# EAGLE design rt_ctl (EAGLE 5.10)
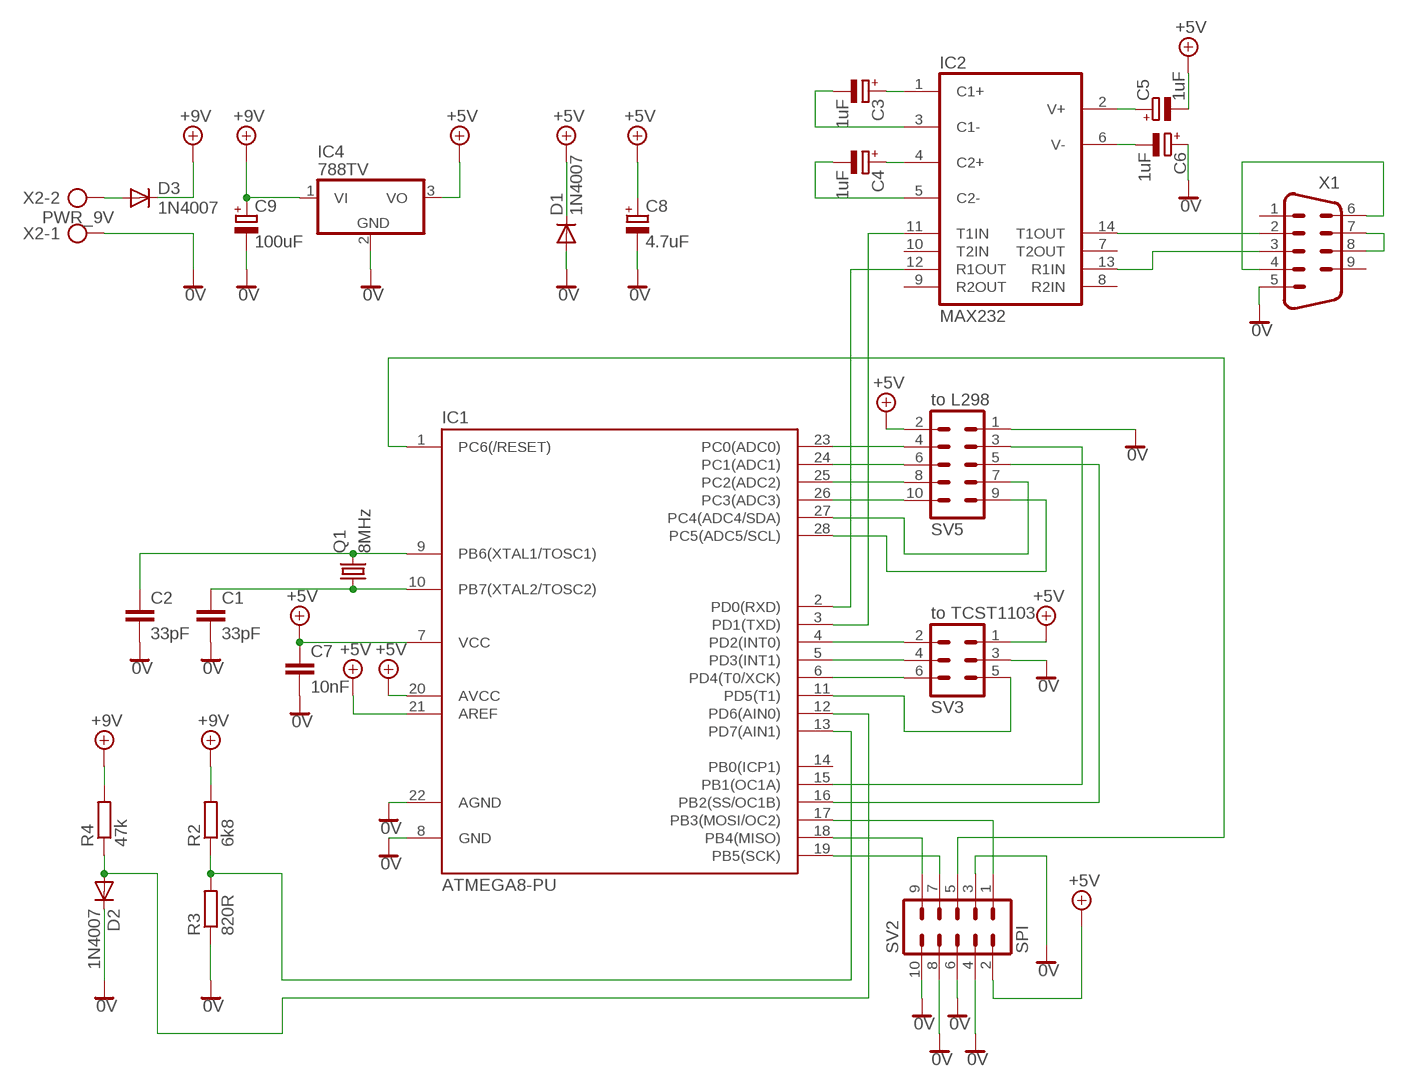
[diagram p0: schematic, sheet 1]

## Parts
C1  33pF  C7.5/3  [C7.5B3]
C2  33pF  C7.5/3  [C7.5B3]
C3  1uF  CPOL-EUE2.5-5  [E2,5-5]
C4  1uF  CPOL-EUE2.5-5  [E2,5-5]
C5  1uF  CPOL-EUE2.5-5  [E2,5-5]
C6  1uF  CPOL-EUE2.5-5  [E2,5-5]
C7  10nF  C7.5/3  [C7.5B3]
C8  4.7uF  CPOL-EUE2.5-7  [E2,5-7]
C9  100uF  CPOL-EUE3.5-10  [E3,5-10]
D1  1N4007  1N4004  [DO41-10]
D2  1N4007  1N4004  [DO41-10]
D3  1N4007  1N4004  [DO41-10]
IC1  ATMEGA8-PU  [DIL28-3]
IC2  MAX232  [DIL16]
IC4  788TV  [TO220V]
Q1  8MHz  CRYSTALHC49U-V  [HC49U-V]
R2  6k8  R-EU_0207/12  [0207/12]
R3  820R  R-EU_0207/12  [0207/12]
R4  47k  R-EU_0207/12  [0207/12]
SV2  SPI  ML10  [ML10]
SV3  to TCST1103  ML6  [ML6]
SV5  to L298  ML10  [ML10]
X1  M09HP  [M09HP]
X2  PWR_9V  AK300/2  [AK300/2]

## Nets
+5V: C5.- C7.1 C8.+ D1.C IC1.7(VCC) IC1.20(AVCC) IC1.21(AREF) IC4.3(VO) SV2.2 SV3.1 SV5.2
+9V: C9.+ D3.C IC4.1(VI) R2.2 R4.2
AAA: C1.2 C2.2 C6.+ C7.2 C8.- C9.- D1.A D2.C IC1.8(GND) IC1.22(AGND) IC4.2(GND) R3.1 SV2.3 SV2.4 SV2.6 SV2.8 SV2.10 SV3.3 SV5.1 X1.5 X2.1 ; supply symbol labelled 0V
N$1: C2.1 IC1.9(PB6(XTAL1/TOSC1)) Q1.2
N$2: C1.1 IC1.10(PB7(XTAL2/TOSC2)) Q1.1
N$3: IC1.1(PC6(/RESET)) SV2.5
N$4: IC1.2(PD0(RXD)) IC2.12(R1OUT)
N$5: IC1.3(PD1(TXD)) IC2.11(T1IN)
N$6: C3.+ IC2.1(C1+)
N$7: C4.+ IC2.4(C2+)
N$8: C5.+ IC2.2(V+)
N$9: C6.- IC2.6(V-)
N$10: C3.- IC2.3(C1-)
N$11: C4.- IC2.5(C2-)
N$12: IC2.14(T1OUT) X1.2
N$13: IC2.13(R1IN) X1.3
N$14: D2.A IC1.12(PD6(AIN0)) R4.1
N$15: X1.7 X1.8
N$16: X1.4 X1.6
N$17: IC1.23(PC0(ADC0)) SV5.4
N$18: IC1.24(PC1(ADC1)) SV5.6
N$19: IC1.25(PC2(ADC2)) SV5.8
N$20: IC1.26(PC3(ADC3)) SV5.10
N$21: IC1.27(PC4(ADC4/SDA)) SV5.7
N$22: IC1.28(PC5(ADC5/SCL)) SV5.9
N$23: IC1.15(PB1(OC1A)) SV5.3
N$24: D3.A X2.2
N$25: IC1.13(PD7(AIN1)) R2.1 R3.2
N$26: IC1.16(PB2(SS/OC1B)) SV5.5
N$27: IC1.4(PD2(INT0)) SV3.2
N$28: IC1.5(PD3(INT1)) SV3.4
N$29: IC1.18(PB4(MISO)) SV2.9
N$30: IC1.19(PB5(SCK)) SV2.7
N$31: IC1.17(PB3(MOSI/OC2)) SV2.1
N$32: IC1.6(PD4(T0/XCK)) SV3.6
N$33: IC1.11(PD5(T1)) SV3.5
Unconnected: IC1.14(PB0(ICP1)) IC2.7(T2OUT) IC2.8(R2IN) IC2.9(R2OUT) IC2.10(T2IN) X1.1 X1.9

## Power pins joined to a net without a drawn wire
GND: IC2.15(GND)
VCC: IC2.16(VCC)

## Library data of the parts
C1 C2 C7 = capacitor-wima:C: CAPACITOR naming: grid - package width
C3-C6 C8 C9 = rcl:CPOL-EU: POLARIZED CAPACITOR, European symbol
D1-D3 = diode:1N4004: DIODE general purpose rectifier, 1 A
IC1 = atmega8:ATMEGA8-PU
IC2 = maxim:MAX232: RS232 TRANSEIVER
IC4 = linear:78*: Positive VOLTAGE REGULATOR Source: http://cache.national.com/ds/LM/LM78L05.pdf http://www.fairchildsemi.com/ds/LM/LM7805.pdf
Q1 = crystal:CRYSTAL: CRYSTAL
R2-R4 = resistor:R-EU_: RESISTOR, European symbol
SV2 SV5 = con-harting-ml:ML10: HARTING
SV3 = con-harting-ml:ML6: HARTING
X1 = con-subd:M09: SUB-D
X2 = con-ptr500:AK300/2: CONNECTOR

## Board
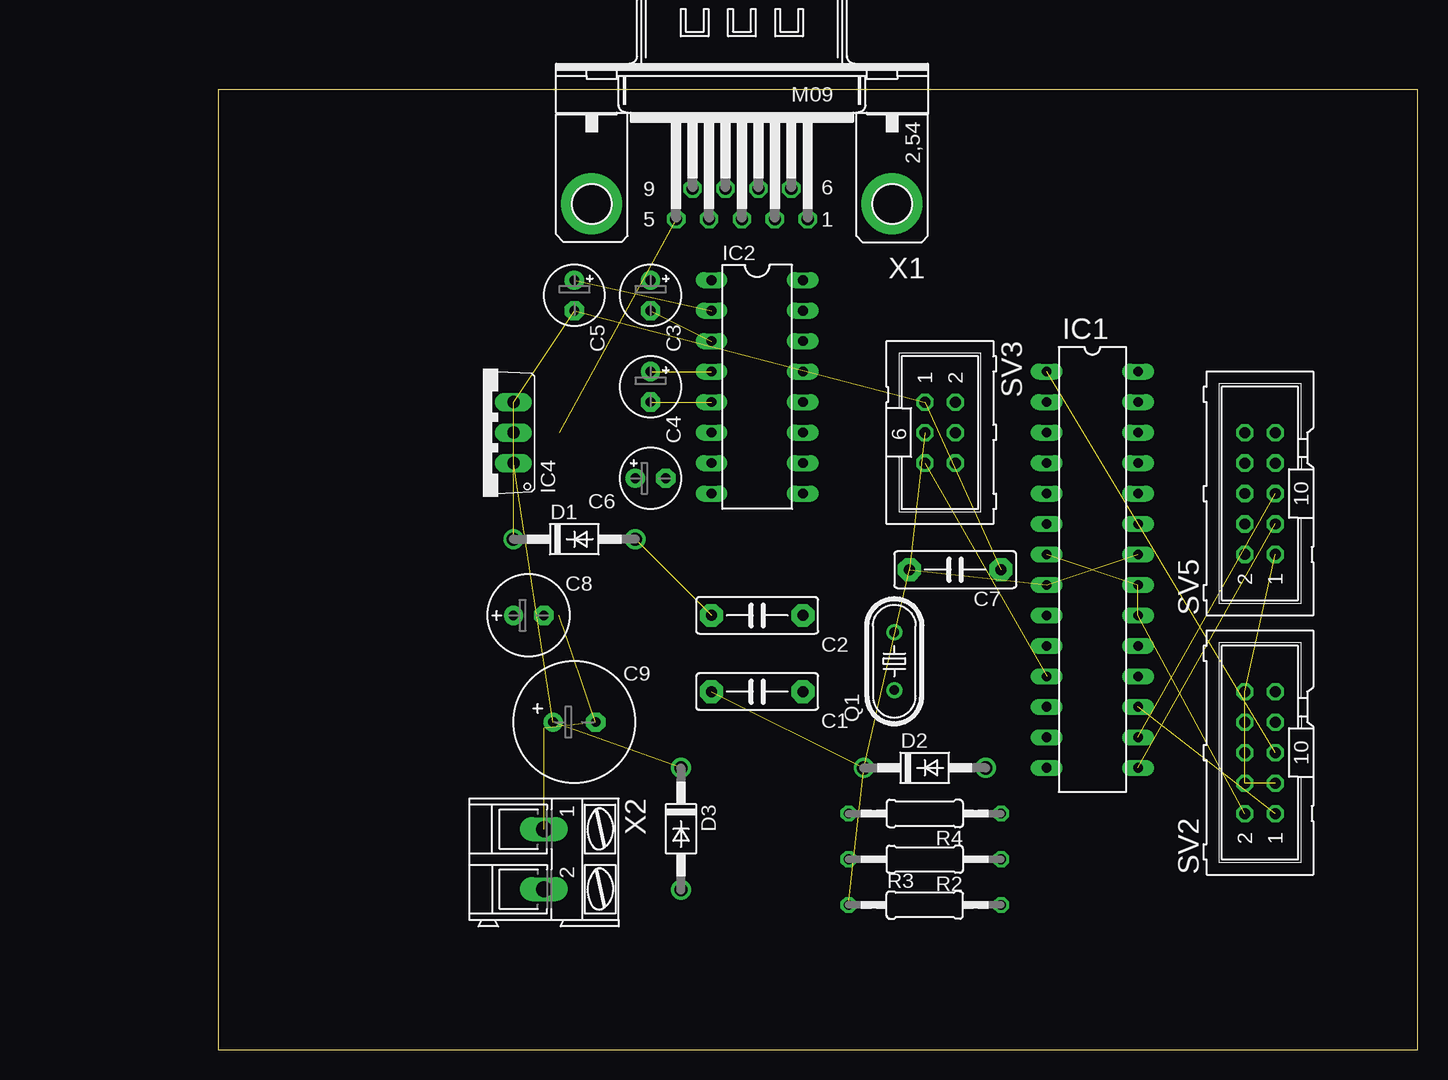
[diagram p1: board, top side]
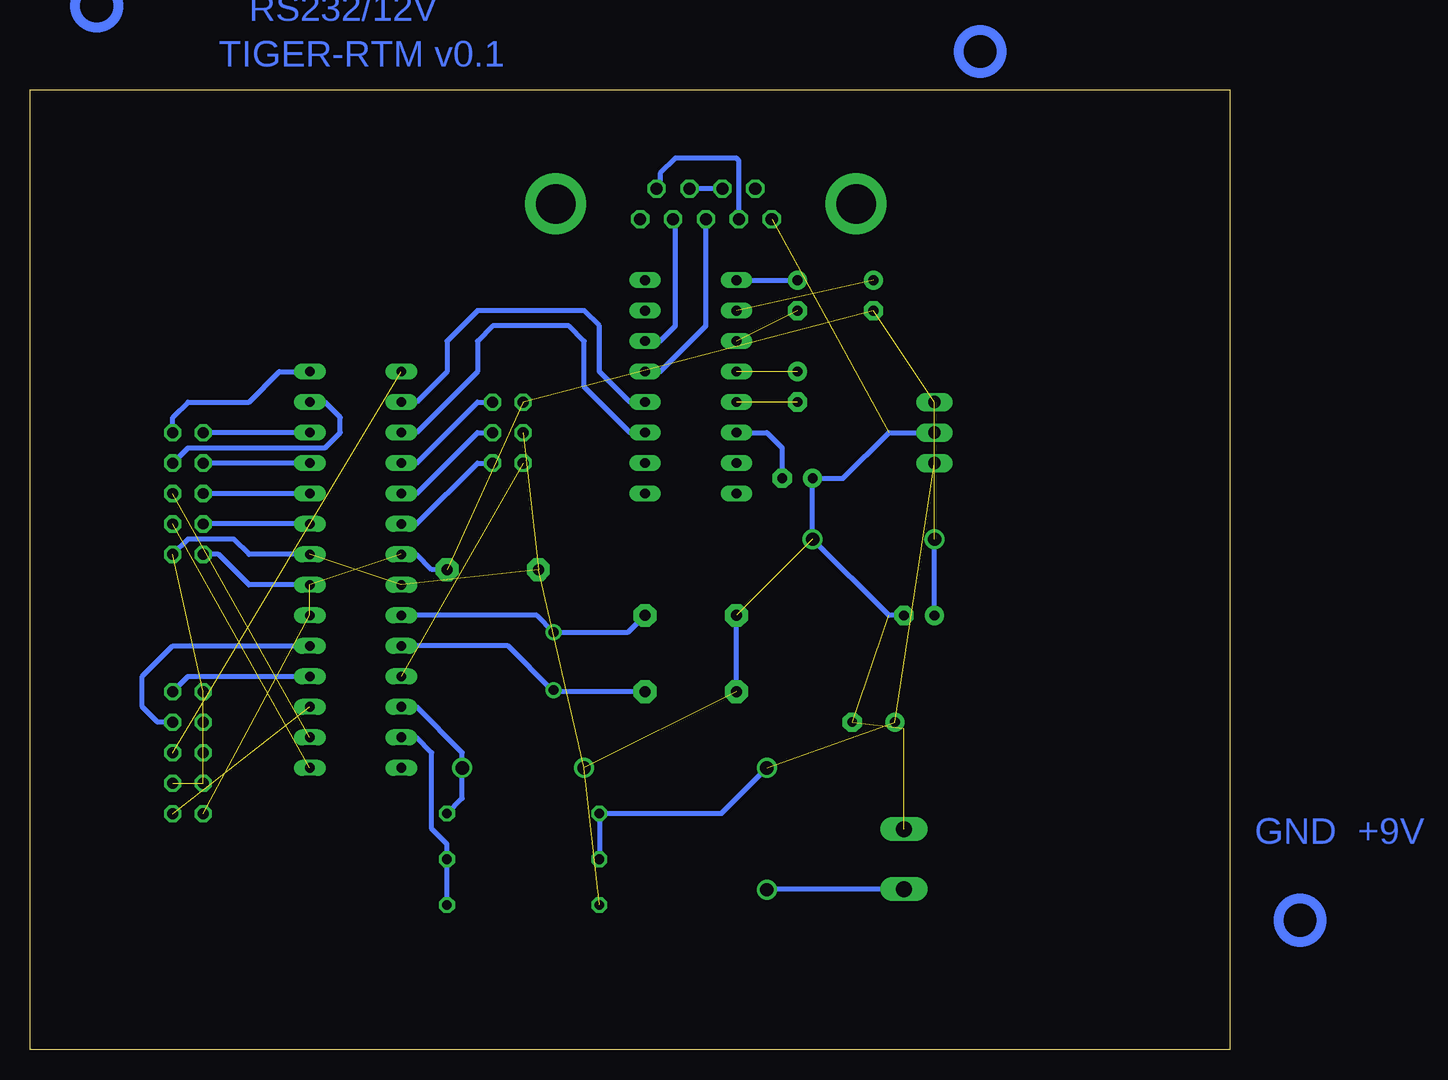
[diagram p2: board, bottom side, seen from below]

Size 100 x 80 mm. Coordinates in mm from the lower left corner, seen from the top.
Outline: 0,0 100,0 100,80 0,80 0,0
Copper layers (1*16): Top 0.035mm / dielectric 1.5mm / Bottom 0.035mm
Design rules "default": minimum track width 10mil, minimum drill 24mil, track to track 8mil, track to pad 8mil, pad to pad 8mil, via to via 8mil, smd to smd 8mil, copper to edge 40mil, drill to drill 8mil, minimum pad ring 10mil, minimum via ring 8mil, stop-mask expansion 4mil, vias tented up to drill 0mil, thermal gap 10mil

### Footprints (pad centres in the part's own frame; a part is rotated, then mirrored left to right if it is on the bottom)
C7.5B3 = drill 0.914 pad 1.905 octagon: 1 -3.81,0; 2 3.81,0
E2,5-5 = drill 0.813 pad 1.6 round: + -1.27,0 | drill 0.813 pad 1.6 octagon: - 1.27,0
E2,5-7 = drill 0.813 pad 1.6 round: + -1.27,0 | drill 0.813 pad 1.6 octagon: - 1.27,0
E3,5-10 = drill 0.813 pad 1.6 round: + -1.778,0 | drill 0.813 pad 1.6 octagon: - 1.778,0
DO41-10 = drill 1.118 round: A 5.08,0; C -5.08,0
DIL28-3 = drill 0.813 long: 1 -16.51,-3.81; 2 -13.97,-3.81; 3 -11.43,-3.81; 4 -8.89,-3.81; 5 -6.35,-3.81; 6 -3.81,-3.81; 7 -1.27,-3.81; 8 1.27,-3.81; 9 3.81,-3.81; 10 6.35,-3.81; 11 8.89,-3.81; 12 11.43,-3.81; 13 13.97,-3.81; 14 16.51,-3.81; 15 16.51,3.81; 16 13.97,3.81; 17 11.43,3.81; 18 8.89,3.81; 19 6.35,3.81; 20 3.81,3.81; 21 1.27,3.81; 22 -1.27,3.81; 23 -3.81,3.81; 24 -6.35,3.81; 25 -8.89,3.81; 26 -11.43,3.81; 27 -13.97,3.81; 28 -16.51,3.81
DIL16 = drill 0.813 long: 1 -8.89,-3.81; 2 -6.35,-3.81; 3 -3.81,-3.81; 4 -1.27,-3.81; 5 1.27,-3.81; 6 3.81,-3.81; 7 6.35,-3.81; 8 8.89,-3.81; 9 8.89,3.81; 10 6.35,3.81; 11 3.81,3.81; 12 1.27,3.81; 13 -1.27,3.81; 14 -3.81,3.81; 15 -6.35,3.81; 16 -8.89,3.81
TO220V = drill 1.016 long: 1 -2.54,-2.54; 2 0,-2.54; 3 2.54,-2.54
HC49U-V = drill 0.813 round: 1 -2.413,0; 2 2.413,0
0207/12 = drill 0.813 octagon: 1 -6.35,0; 2 6.35,0
ML10 = drill 0.914 octagon: 1 -5.08,-1.27; 2 -5.08,1.27; 3 -2.54,-1.27; 4 -2.54,1.27; 5 0,-1.27; 6 0,1.27; 7 2.54,-1.27; 8 2.54,1.27; 9 5.08,-1.27; 10 5.08,1.27
ML6 = drill 0.914 octagon: 1 -2.54,-1.27; 2 -2.54,1.27; 3 0,-1.27; 4 0,1.27; 5 2.54,-1.27; 6 2.54,1.27
M09HP = drill 1.016 octagon: 1 -5.486,1.27; 2 -2.743,1.27; 3 0,1.27; 4 2.743,1.27; 5 5.486,1.27; 6 -4.115,-1.27; 7 -1.372,-1.27; 8 1.372,-1.27; 9 4.115,-1.27 | drill 3.302 pad 5.08 round: G1 -12.522,0; G2 12.522,0
AK300/2 = drill 1.321 long: 1 -2.515,0; 2 2.489,0

### Placement (x,y rotation side)
C1  44.92,29.84 180 top
C2  44.92,36.19 180 top
C3  36.03,62.86 270 top
C4  36.03,55.24 270 top
C5  29.68,62.86 270 top
C6  36.03,47.62 0 top
C7  61.43,40 180 top
C8  25.87,36.19 0 top
C9  29.68,27.3 0 top
D1  29.68,42.54 0 top
D2  58.89,23.49 0 top
D3  38.57,18.41 270 top
IC1  72.86,40 270 top
IC2  44.92,55.24 270 top
IC4  22.06,51.43 90 top
Q1  56.35,32.38 90 top
R2  58.89,15.87 180 top
R3  58.89,12.06 0 top
R4  58.89,19.68 180 top
SV2  86.83,24.76 90 top
SV3  60.16,51.43 270 top
SV5  86.83,46.35 90 top
X1  43.65,70.48 180 top
X2  27.14,15.87 270 top

### Tracks (layer width: path | path; a pad name or v marks a point on that pad's centre or on a via)
+5V  (7 unrouted)
  Bottom 0.406: IC1.21 81.75,38.73 84.29,41.27 SV5.2 | C7.1 66.51,40 67.78,41.27 IC1.7 | C8.+ D1.C
+9V  (2 unrouted)
  Bottom 0.406: D3.C 42.38,19.68 R4.2 R2.2
AAA  (16 unrouted)
  Bottom 0.406: SV5.1 86.83,42.54 83.02,42.54 81.75,41.27 IC1.22 | C1.2 C2.2 | C8.- 28.41,36.19 D1.A C6.+ 32.22,47.62 28.41,51.43 IC4.2
N$1
  Bottom 0.406: IC1.9 57.75,36.19 Q1.2 50.13,34.79 C2.1
N$2
  Bottom 0.406: C1.1 56.22,29.84 Q1.1 56.48,29.97 60.16,33.65 IC1.10
N$3  (1 unrouted)
N$4
  Bottom 0.406: IC2.12 50,53.97 52.54,56.51 52.54,60.32 53.81,61.59 62.7,61.59 65.24,59.05 65.24,56.51 67.78,53.97 IC1.2
N$5
  Bottom 0.406: IC2.11 50,51.43 53.81,55.24 53.81,59.05 55.08,60.32 61.43,60.32 62.7,59.05 62.7,56.51 67.78,51.43 IC1.3
N$6
  Bottom 0.406: IC2.1 C3.+
N$7  (1 unrouted)
N$8  (1 unrouted)
N$9
  Bottom 0.406: IC2.6 38.57,51.43 37.3,50.16 C6.-
N$10  (1 unrouted)
N$11  (1 unrouted)
N$12
  Bottom 0.406: IC2.14 47.46,59.05 46.19,60.32 46.19,69.01 X1.2
N$13
  Bottom 0.406: IC2.13 47.46,56.51 43.65,60.32 X1.3
N$14
  Bottom 0.406: R4.1 63.97,20.95 D2.A 63.97,24.76 67.78,28.57 IC1.12
N$15
  Bottom 0.406: X1.8 X1.7
N$16
  Bottom 0.406: X1.4 40.91,74.09 41.11,74.29 46.19,74.29 47.46,73.02 47.46,72.05 X1.6
N$17
  Bottom 0.406: IC1.23 SV5.4
N$18
  Bottom 0.406: IC1.24 SV5.6
N$19
  Bottom 0.406: IC1.25 SV5.8
N$20
  Bottom 0.406: IC1.26 SV5.10
N$21
  Bottom 0.406: SV5.7 86.83,50.16 75.4,50.16 74.13,51.43 74.13,52.7 75.4,53.97 IC1.27
N$22
  Bottom 0.406: SV5.9 88.1,52.7 86.83,53.97 81.75,53.97 79.21,56.51 IC1.28
N$23  (1 unrouted)
N$24
  Bottom 0.406: X2.2 38.52,13.38 D3.A
N$25
  Bottom 0.406: R3.2 R2.1 65.24,17.14 66.51,18.41 66.51,24.76 67.78,26.03 IC1.13
N$26  (1 unrouted)
N$27
  Bottom 0.406: IC1.4 67.78,48.89 62.7,53.97 SV3.2
N$28
  Bottom 0.406: IC1.5 67.78,46.35 62.7,51.43 SV3.4
N$29
  Bottom 0.406: SV2.9 86.83,31.11 IC1.18
N$30
  Bottom 0.406: SV2.7 89.37,27.3 90.64,28.57 90.64,31.11 88.1,33.65 IC1.19
N$31  (1 unrouted)
N$32
  Bottom 0.406: IC1.6 67.78,43.81 62.7,48.89 SV3.6
N$33  (1 unrouted)
(copper drawn outside any net)
  shapes: Bottom circle x4

### Text on the board
Bottom: RS232/12V | TIGER-RTM v0.1 | GND +9V | SPI